# Altium schematic sheet SD.SchDoc
size A4
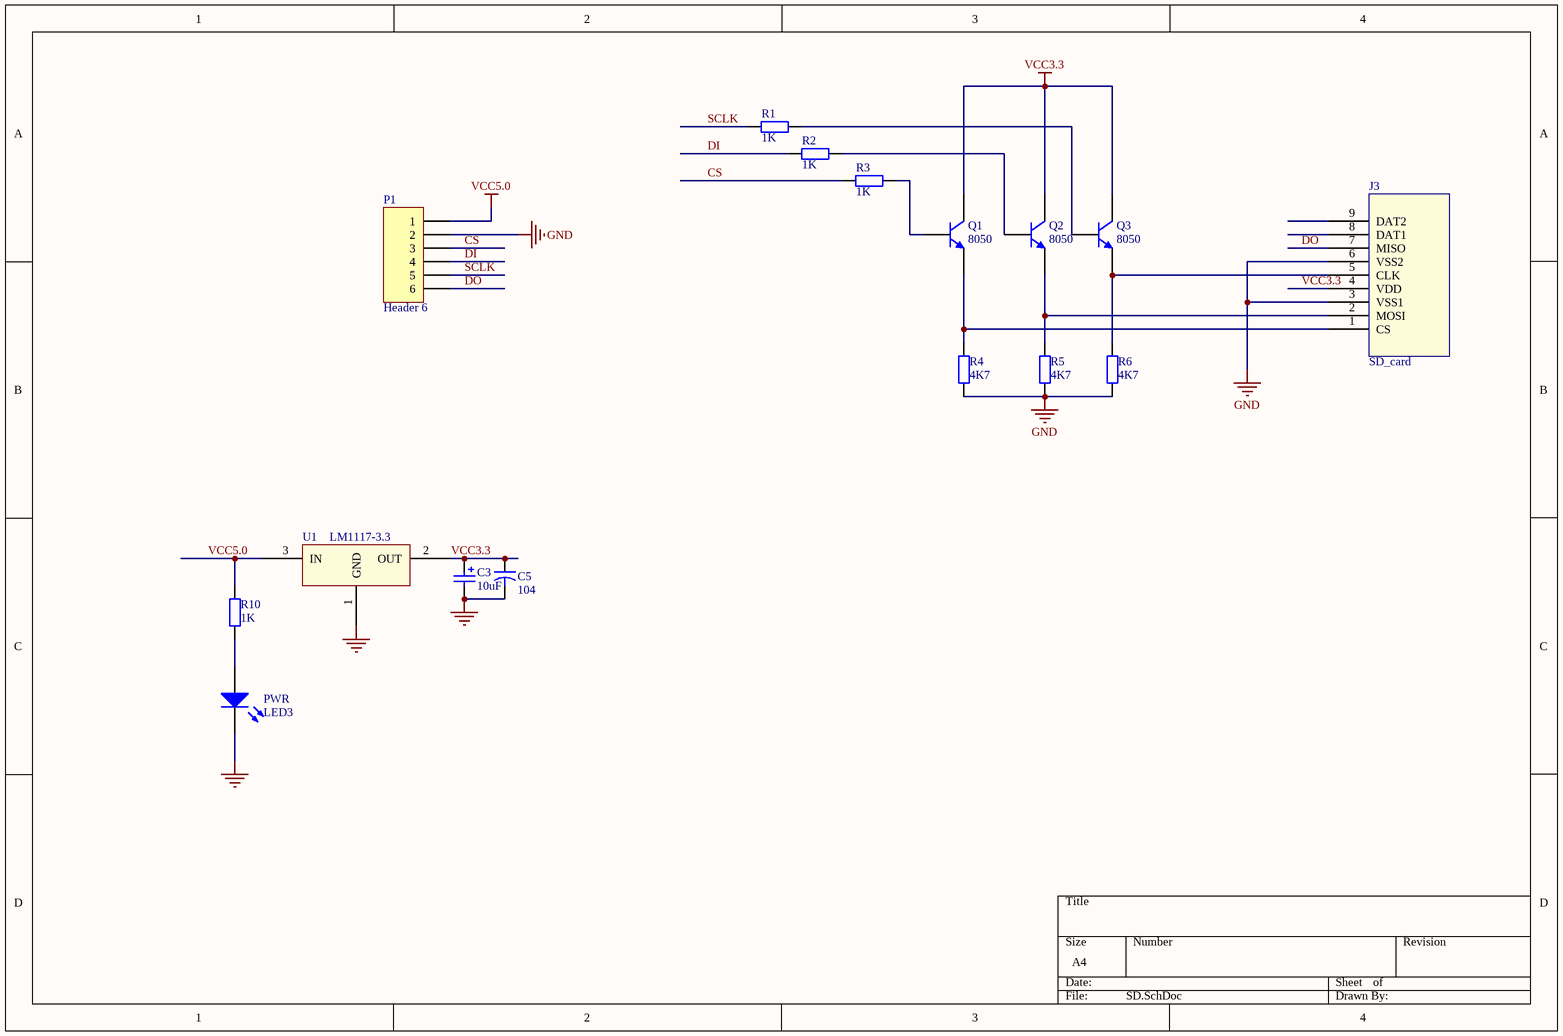
[diagram p0: SD.SchDoc]

## Parts
C3  value 10uF  [CC2012-0805]  (hidden comment: Cap Pol3)
C5  value 104  [CAPR5-4X5]  (hidden comment: Cap2)
J3  SD_card  [SDCARD]
P1  Header 6  [HDR1X6]
PWR  LED3  [SMD _LED]
Q1  8050  [TO-92A]
Q2  8050  [TO-92A]
Q3  8050  [TO-92A]
R1  value 1K  [AXIAL-0.4]  (hidden comment: Res2)
R2  value 1K  [AXIAL-0.4]  (hidden comment: Res2)
R3  value 1K  [AXIAL-0.4]  (hidden comment: Res2)
R4  value 4K7  [AXIAL-0.4]  (hidden comment: Res2)
R5  value 4K7  [AXIAL-0.4]  (hidden comment: Res2)
R6  value 4K7  [AXIAL-0.4]  (hidden comment: Res2)
R10  value 1K  [AXIAL-0.4]  (hidden comment: Res2)
U1  LM1117-3.3  [SOT-223]

## Nets
GND: C3.2 C5.2 J3.3(VSS1) J3.6(VSS2) P1.2 PWR.2(K) R4.1 R5.1 R6.1 U1.1(GND)
VCC3.3: C3.1 C5.1 J3.4(VDD) Q1.3(C) Q2.3(C) Q3.3(C) U1.2(OUT)
VCC5.0: P1.1 R10.1 U1.3(IN)
CS: P1.3 R3.1
DI: P1.4 R2.1
DO: J3.7(MISO) P1.6
SCLK: P1.5 R1.1
NetJ3_1: J3.1(CS) Q1.1(E) R4.2
NetJ3_2: J3.2(MOSI) Q2.1(E) R5.2
NetJ3_5: J3.5(CLK) Q3.1(E) R6.2
NetPWR_1: PWR.1(A) R10.2
NetQ1_2: Q1.2(B) R3.2
NetQ2_2: Q2.2(B) R2.2
NetQ3_2: Q3.2(B) R1.2

Not connected (* = marked no-connect by the designer): J3 8(DAT1) 9(DAT2)

## Library data of the parts
C3 = Cap Pol3: Polarized Capacitor (Surface Mount); Published: 8-Jun-2000; Revision: July-2002: Re-released for DXP Platform.; Publisher: Altium Limited
C5 = Cap2: Capacitor; Published: 23-Sep-2002; PackageReference: CAPR5-4X5; Publisher: Altium Limited
P1 = Header 6: Header, 6-Pin; LatestRevisionDate: 17-Jul-2002; LatestRevisionNote: Re-released for DXP Platform.; Publisher: Altium Limited
PWR = LED3: Typical BLUE SiC LED; Revision 1: Jul-2002: Re-released for DXP Platform.; Revision 2: 17-Dec-2003: PCB Footprint replaced.; Published: 8-Jun-2000; Publisher: Altium Limited
Q1-Q3 = 2N3904: NPN General Purpose Amplifier; Published: 8-Jun-2000; LatestRevisionDate: 15-Jan-2003; LatestRevisionNote: PCB Footprint 'BCY-W3/D4.7' replaced; DatasheetDocument: 1997; PackageDocument: Sep-1998; PackageReference: TO-92A; Publisher: Altium Limited; Code_JEDEC: TO-92A; ComponentLink1Description: Manufacturer Link; ComponentLink1URL: http://www.fairchildsemi.com/; ComponentLink2Description: Datasheet; ComponentLink2URL: http://www.fairchildsemi.com/ds/2N%2F2N3904.pdf
R1-R6 R10 = Res2: Resistor; Published: 8-Jun-2000; Publisher: Altium Limited
  R1-R6: LatestRevisionDate: 17-Jul-2002; LatestRevisionNote: Re-released for DXP Platform.; PackageReference: AXIAL-0.4
  R10: Revision: July-2002: Re-released for DXP Platform.